# EAGLE schematic OSSISolarY (EAGLE 6.5.0)
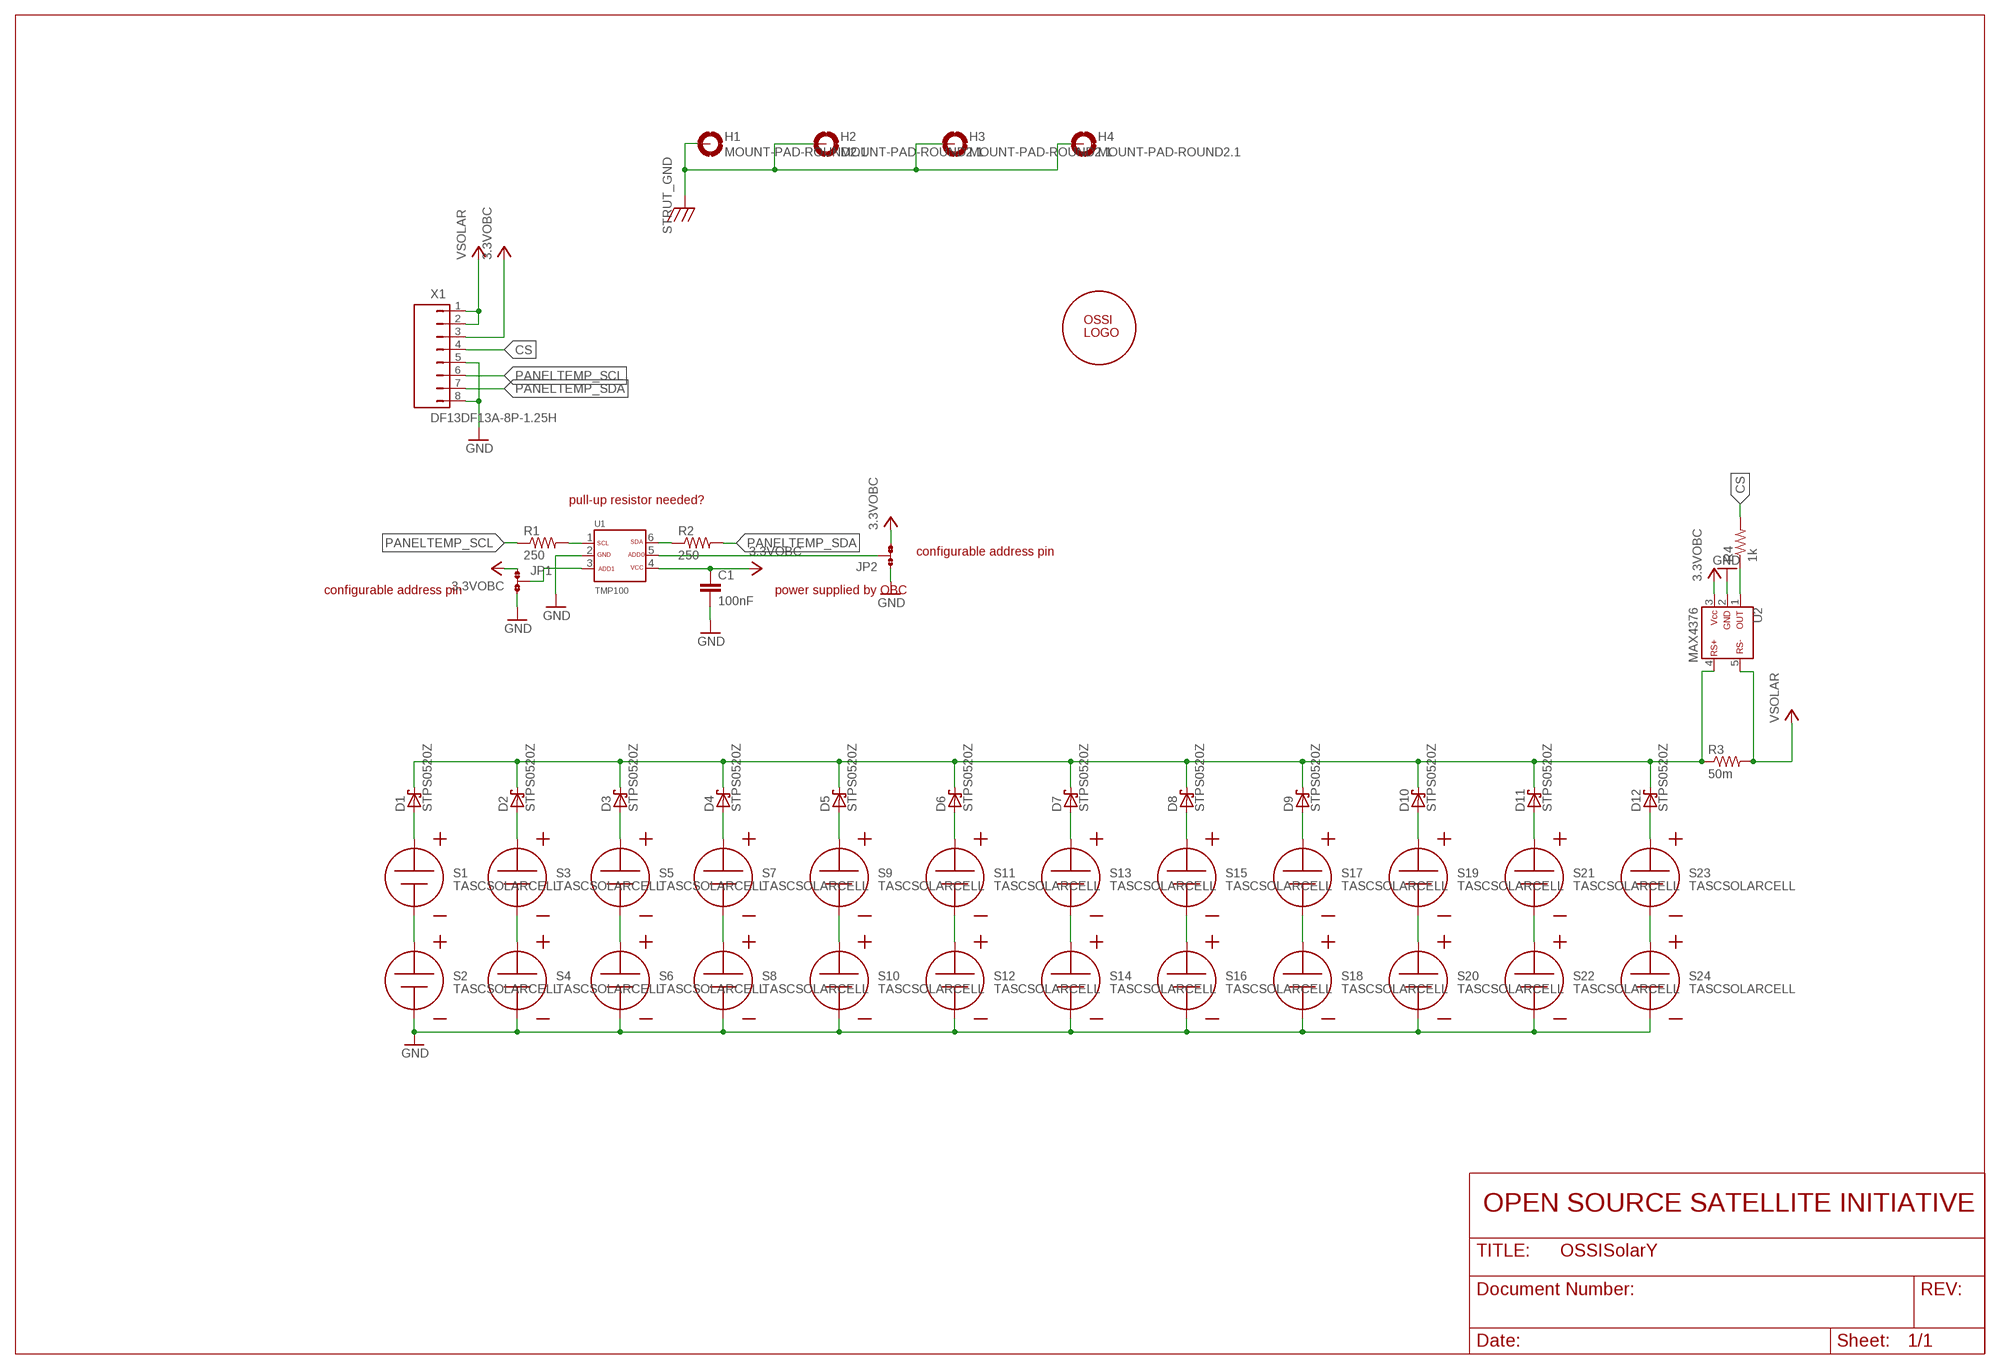
[diagram p0: schematic, sheet 1]

## Parts
C1  100nF  C0603(1608)  [C0603(1608)]
D1  STPS0520Z  [SOD-123]
D2  STPS0520Z  [SOD-123]
D3  STPS0520Z  [SOD-123]
D4  STPS0520Z  [SOD-123]
D5  STPS0520Z  [SOD-123]
D6  STPS0520Z  [SOD-123]
D7  STPS0520Z  [SOD-123]
D8  STPS0520Z  [SOD-123]
D9  STPS0520Z  [SOD-123]
D10  STPS0520Z  [SOD-123]
D11  STPS0520Z  [SOD-123]
D12  STPS0520Z  [SOD-123]
H1  MOUNT-PAD-ROUND2.1  [2.1-PAD-ROUND]
H2  MOUNT-PAD-ROUND2.1  [2.1-PAD-ROUND]
H3  MOUNT-PAD-ROUND2.1  [2.1-PAD-ROUND]
H4  MOUNT-PAD-ROUND2.1  [2.1-PAD-ROUND]
JP1  JP2  [JP2SMD0603]
JP2  JP2  [JP2SMD0603]
R1  250  R0603(1608)  [R0603(1608)]
R2  250  R0603(1608)  [R0603(1608)]
R3  50m  RWSL1206  [WSL1206]
R4  1k  R0603(1608)  [R0603(1608)]
S1  TASCSOLARCELL  [TASCSOLARCELL]
S2  TASCSOLARCELL  [TASCSOLARCELL]
S3  TASCSOLARCELL  [TASCSOLARCELL]
S4  TASCSOLARCELL  [TASCSOLARCELL]
S5  TASCSOLARCELL  [TASCSOLARCELL]
S6  TASCSOLARCELL  [TASCSOLARCELL]
S7  TASCSOLARCELL  [TASCSOLARCELL]
S8  TASCSOLARCELL  [TASCSOLARCELL]
S9  TASCSOLARCELL  [TASCSOLARCELL]
S10  TASCSOLARCELL  [TASCSOLARCELL]
S11  TASCSOLARCELL  [TASCSOLARCELL]
S12  TASCSOLARCELL  [TASCSOLARCELL]
S13  TASCSOLARCELL  [TASCSOLARCELL]
S14  TASCSOLARCELL  [TASCSOLARCELL]
S15  TASCSOLARCELL  [TASCSOLARCELL]
S16  TASCSOLARCELL  [TASCSOLARCELL]
S17  TASCSOLARCELL  [TASCSOLARCELL]
S18  TASCSOLARCELL  [TASCSOLARCELL]
S19  TASCSOLARCELL  [TASCSOLARCELL]
S20  TASCSOLARCELL  [TASCSOLARCELL]
S21  TASCSOLARCELL  [TASCSOLARCELL]
S22  TASCSOLARCELL  [TASCSOLARCELL]
S23  TASCSOLARCELL  [TASCSOLARCELL]
S24  TASCSOLARCELL  [TASCSOLARCELL]
U1  TMP100  [SOT23-6DBV]
U2  MAX4376  [SOT23-5DBV]
U$2  OSSILOGO  [OSSILOGORECT1005]
X1  DF13DF13A-8P-1.25H  [DF13A-8P]

## Nets
3.3VOBC: C1.1 JP1.1 JP2.3 U1.4 U2.3 X1.3
CS: R4.2 X1.4
GND: C1.2 JP1.3 JP2.1 S2.N S4.N S6.N S8.N S10.N S12.N S14.N S16.N S18.N S20.N S22.N S24.N U1.2 U2.2 X1.5 X1.8
N$1: S1.N S2.P
N$2: D1.A S1.P
N$3: S3.N S4.P
N$4: D2.A S3.P
N$5: S5.N S6.P
N$6: D3.A S5.P
N$7: S7.N S8.P
N$8: D4.A S7.P
N$9: S9.N S10.P
N$10: D5.A S9.P
N$11: S11.N S12.P
N$12: D6.A S11.P
N$13: S13.N S14.P
N$14: D7.A S13.P
N$15: S15.N S16.P
N$16: D8.A S15.P
N$17: S17.N S18.P
N$18: D9.A S17.P
N$19: S19.N S20.P
N$20: D10.A S19.P
N$21: S21.N S22.P
N$22: D11.A S21.P
N$23: S23.N S24.P
N$24: D12.A S23.P
N$25: R1.2 U1.1
N$26: R2.1 U1.6
N$27: D1.C D2.C D3.C D4.C D5.C D6.C D7.C D8.C D9.C D10.C D11.C D12.C R3.P$1 U2.4
N$28: JP1.2 U1.3
N$29: JP2.2 U1.5
N$30: R4.1 U2.1
PANELTEMP_SCL: R1.1 X1.6
PANELTEMP_SDA: R2.2 X1.7
STRUT_GND: H1.B3,2(MOUNT) H2.B3,2(MOUNT) H3.B3,2(MOUNT) H4.B3,2(MOUNT)
VSOLAR: R3.P$2 U2.5 X1.1 X1.2

## Notes on the sheet
- pull-up resistor needed?
- configurable address pin
- configurable address pin | power supplied by OBC
- OPEN SOURCE SATELLITE INITIATIVE

## Library data of the parts
C1 = OSSI:C
D1-D12 = OSSI:STPS0520Z: We use STPS0520Z by st.com diode for solar cell schottky diode. If = 500mA Vrrm = 20V Vf max = 0.32V
H1-H4 = OSSI:MOUNT-PAD-ROUND
JP1 JP2 = OSSI:JP2
R1-R4 = OSSI:R
S1-S24 = OSSI:TASCSOLARCELL
U1 = OSSI:TMP100: TMP100 Digital Temerature Sensor with I2C Interface from Texas Instruments
U2 = OSSI:MAX4376
U$2 = OSSI:OSSILOGO
X1 = OSSI:DF13: Hirose DF13 series connector